# EAGLE design HexJacks (EAGLE 6.6.0)
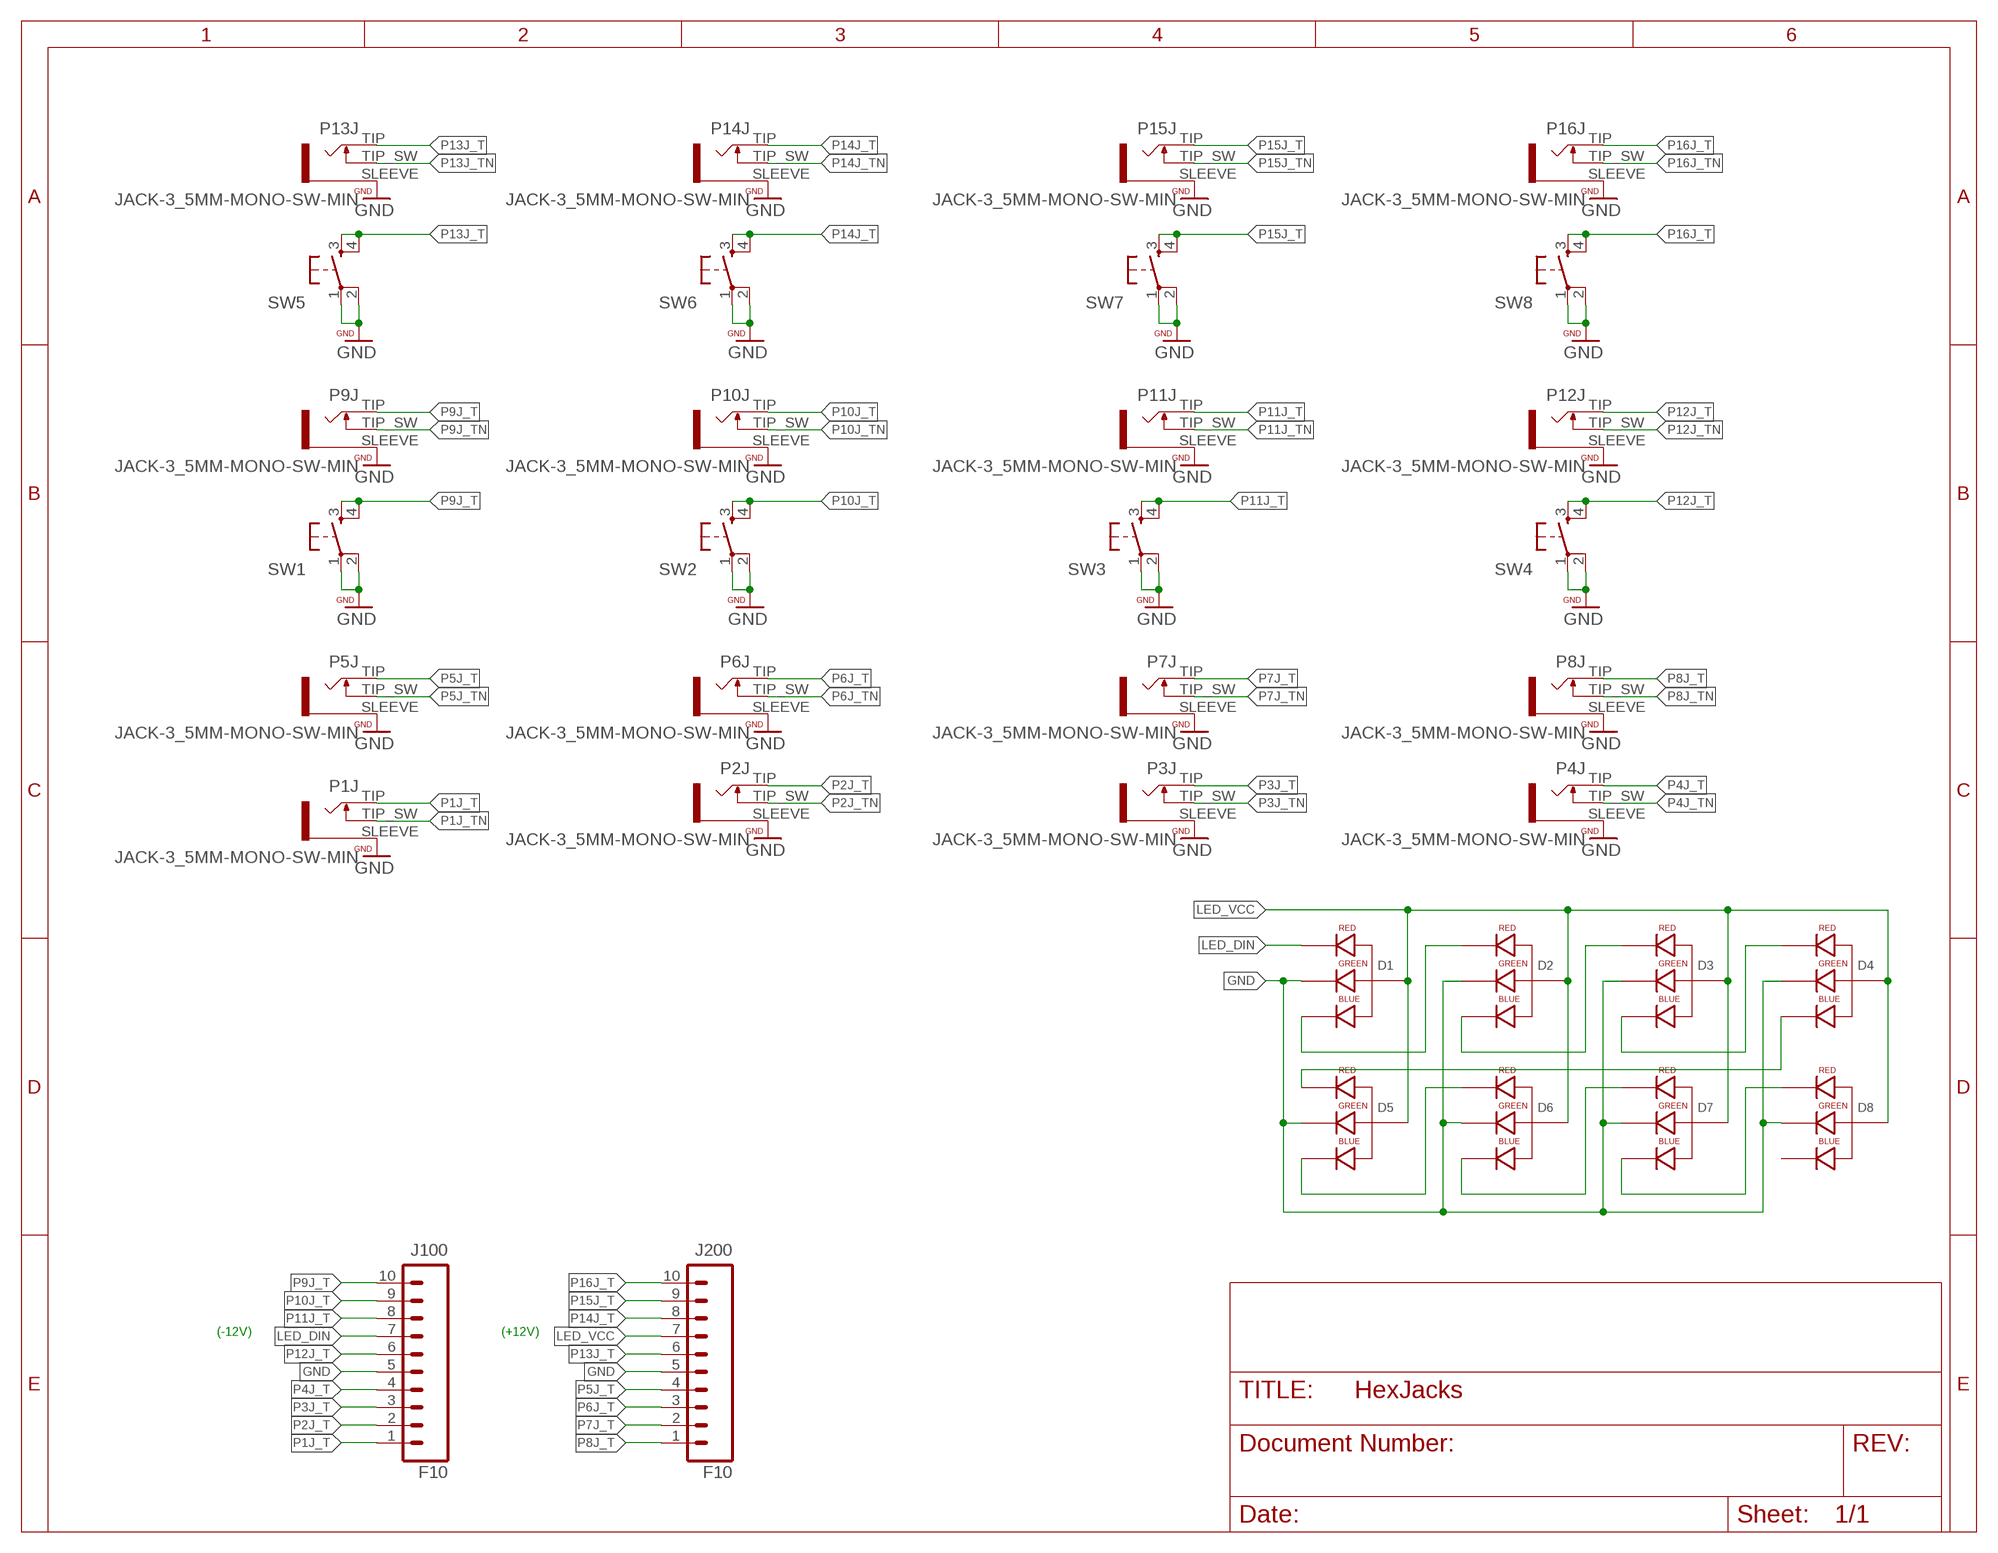
[diagram p0: schematic, sheet 1]

## Parts
D1  LED-RGB-CA-THRUCLEAR  [LED-RGB-THRU]
D2  LED-RGB-CA-THRUCLEAR  [LED-RGB-THRU]
D3  LED-RGB-CA-THRUCLEAR  [LED-RGB-THRU]
D4  LED-RGB-CA-THRUCLEAR  [LED-RGB-THRU]
D5  LED-RGB-CA-THRUCLEAR  [LED-RGB-THRU]
D6  LED-RGB-CA-THRUCLEAR  [LED-RGB-THRU]
D7  LED-RGB-CA-THRUCLEAR  [LED-RGB-THRU]
D8  LED-RGB-CA-THRUCLEAR  [LED-RGB-THRU]
J100  F10  M10SILK_FEMALE_PTH  [1X10_OCTO]
J200  F10  M10SILK_FEMALE_PTH  [1X10_OCTO]
P1J  JACK-3_5MM-MONO-SW-MIN  [WQP_PJ301M-MIN]
P2J  JACK-3_5MM-MONO-SW-MIN  [WQP_PJ301M-MIN]
P3J  JACK-3_5MM-MONO-SW-MIN  [WQP_PJ301M-MIN]
P4J  JACK-3_5MM-MONO-SW-MIN  [WQP_PJ301M-MIN]
P5J  JACK-3_5MM-MONO-SW-MIN  [WQP_PJ301M-MIN]
P6J  JACK-3_5MM-MONO-SW-MIN  [WQP_PJ301M-MIN]
P7J  JACK-3_5MM-MONO-SW-MIN  [WQP_PJ301M-MIN]
P8J  JACK-3_5MM-MONO-SW-MIN  [WQP_PJ301M-MIN]
P9J  JACK-3_5MM-MONO-SW-MIN  [WQP_PJ301M-MIN]
P10J  JACK-3_5MM-MONO-SW-MIN  [WQP_PJ301M-MIN]
P11J  JACK-3_5MM-MONO-SW-MIN  [WQP_PJ301M-MIN]
P12J  JACK-3_5MM-MONO-SW-MIN  [WQP_PJ301M-MIN]
P13J  JACK-3_5MM-MONO-SW-MIN  [WQP_PJ301M-MIN]
P14J  JACK-3_5MM-MONO-SW-MIN  [WQP_PJ301M-MIN]
P15J  JACK-3_5MM-MONO-SW-MIN  [WQP_PJ301M-MIN]
P16J  JACK-3_5MM-MONO-SW-MIN  [WQP_PJ301M-MIN]
SW1  TAC_SWITCHPTH  [TACTILE-PTH]
SW2  TAC_SWITCHPTH  [TACTILE-PTH]
SW3  TAC_SWITCHPTH  [TACTILE-PTH]
SW4  TAC_SWITCHPTH  [TACTILE-PTH]
SW5  TAC_SWITCHPTH  [TACTILE-PTH]
SW6  TAC_SWITCHPTH  [TACTILE-PTH]
SW7  TAC_SWITCHPTH  [TACTILE-PTH]
SW8  TAC_SWITCHPTH  [TACTILE-PTH]

## Nets
GND: D1.3(GREEN_CATHODE) D2.3(GREEN_CATHODE) D3.3(GREEN_CATHODE) D4.3(GREEN_CATHODE) D5.3(GREEN_CATHODE) D6.3(GREEN_CATHODE) D7.3(GREEN_CATHODE) D8.3(GREEN_CATHODE) J100.5 J200.5 P1J.SLEEVE P2J.SLEEVE P3J.SLEEVE P4J.SLEEVE P5J.SLEEVE P6J.SLEEVE P7J.SLEEVE P8J.SLEEVE P9J.SLEEVE P10J.SLEEVE P11J.SLEEVE P12J.SLEEVE P13J.SLEEVE P14J.SLEEVE P15J.SLEEVE P16J.SLEEVE SW1.1 SW1.2 SW2.1 SW2.2 SW3.1 SW3.2 SW4.1 SW4.2 SW5.1 SW5.2 SW6.1 SW6.2 SW7.1 SW7.2 SW8.1 SW8.2
LED_DIN: D1.1(RED_CATHODE) J100.7
LED_VCC: D1.2(ANODE) D2.2(ANODE) D3.2(ANODE) D4.2(ANODE) D5.2(ANODE) D6.2(ANODE) D7.2(ANODE) D8.2(ANODE) J200.7
N$1: D1.4(BLUE_CATHODE) D2.1(RED_CATHODE)
N$2: D2.4(BLUE_CATHODE) D3.1(RED_CATHODE)
N$3: D3.4(BLUE_CATHODE) D4.1(RED_CATHODE)
N$4: D4.4(BLUE_CATHODE) D5.1(RED_CATHODE)
N$5: D5.4(BLUE_CATHODE) D6.1(RED_CATHODE)
N$6: D6.4(BLUE_CATHODE) D7.1(RED_CATHODE)
N$7: D7.4(BLUE_CATHODE) D8.1(RED_CATHODE)
P1J_T: J100.1 P1J.TIP
P1J_TN: P1J.TIP_SW
P2J_T: J100.2 P2J.TIP
P2J_TN: P2J.TIP_SW
P3J_T: J100.3 P3J.TIP
P3J_TN: P3J.TIP_SW
P4J_T: J100.4 P4J.TIP
P4J_TN: P4J.TIP_SW
P5J_T: J200.4 P5J.TIP
P5J_TN: P5J.TIP_SW
P6J_T: J200.3 P6J.TIP
P6J_TN: P6J.TIP_SW
P7J_T: J200.2 P7J.TIP
P7J_TN: P7J.TIP_SW
P8J_T: J200.1 P8J.TIP
P8J_TN: P8J.TIP_SW
P9J_T: J100.10 P9J.TIP SW1.3 SW1.4
P9J_TN: P9J.TIP_SW
P10J_T: J100.9 P10J.TIP SW2.3 SW2.4
P10J_TN: P10J.TIP_SW
P11J_T: J100.8 P11J.TIP SW3.3 SW3.4
P11J_TN: P11J.TIP_SW
P12J_T: J100.6 P12J.TIP SW4.3 SW4.4
P12J_TN: P12J.TIP_SW
P13J_T: J200.6 P13J.TIP SW5.3 SW5.4
P13J_TN: P13J.TIP_SW
P14J_T: J200.8 P14J.TIP SW6.3 SW6.4
P14J_TN: P14J.TIP_SW
P15J_T: J200.9 P15J.TIP SW7.3 SW7.4
P15J_TN: P15J.TIP_SW
P16J_T: J200.10 P16J.TIP SW8.3 SW8.4
P16J_TN: P16J.TIP_SW
Unconnected: D8.4(BLUE_CATHODE)

## Notes on the sheet
- (-12V) | (+12V)

## Library data of the parts
D1-D8 = halcyonmod_Optoelectronics:LED-RGB-CA-THRU: RGB Through-hole common anode SparkFun store front COM-10821 (diffuse) COM-10820 (clear); PROD_ID: DIO-10631
J100 J200 = oXo_Connectors:M10: Header 10 Standard 10-pin 0.1" header. Use with straight break away headers (SKU : PRT-00116), right angle break away headers (PRT-00553), swiss pins (PRT-00743), machine pins (PRT-00117), and female headers (PRT-00115).; PROD_ID: CONN-11563
P1J P2J P3J P4J P5J P6J P7J P8J P9J P10J P11J P12J P13J P14J P15J P16J = halcyonmod_Connectors:JACK-3_5MM-MONO-SW: Jack, 3.5mm, RIght Angle, Though-Hole
SW1-SW8 = SparkFun:TAC_SWITCH: Momentary Switch Button commonly used for reset or general input. Spark Fun Electronics SKU : COM-00097

## Board
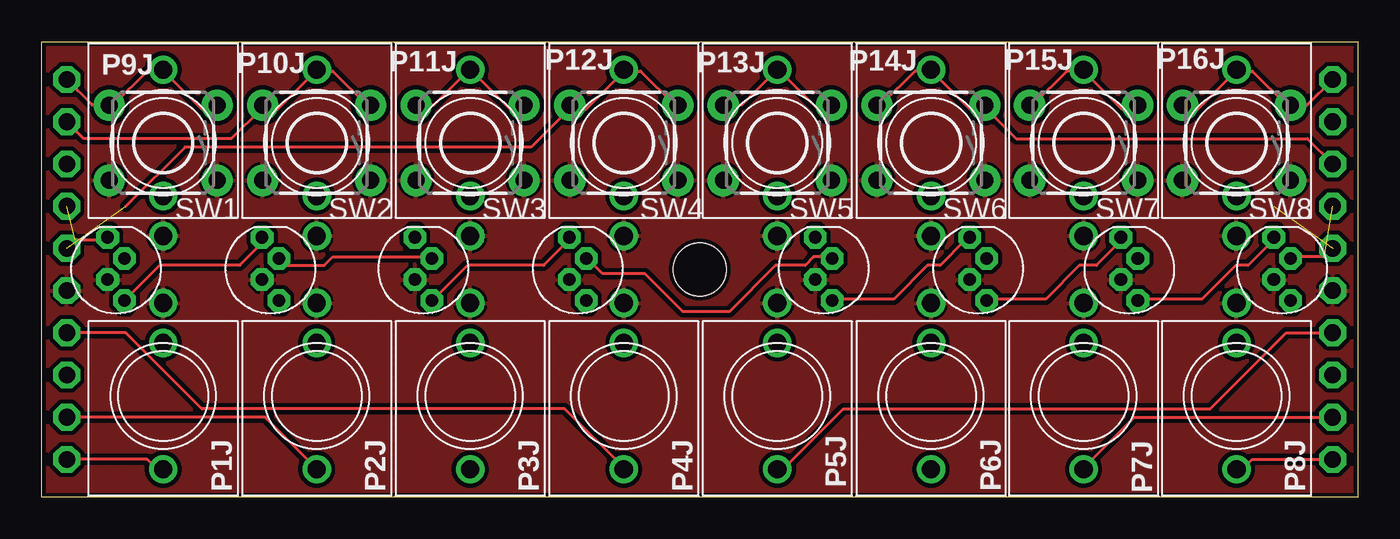
[diagram p1: board, top side]
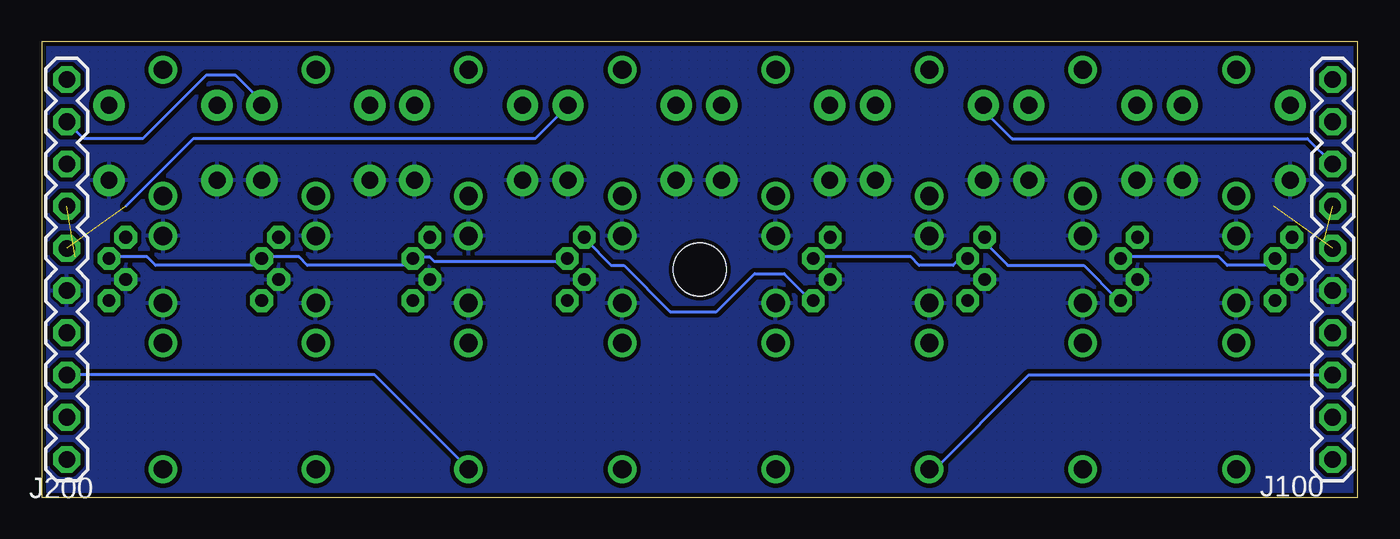
[diagram p2: board, bottom side, seen from below]

Size 79.25 x 27.43 mm. Coordinates in mm from the lower left corner, seen from the top.
Outline: 79.25,0 0,0 0,27.43 79.25,27.43 79.25,0
Copper layers (1*16): Top 0.035mm / dielectric 1.5mm / Bottom 0.035mm
Design rules "PatternAgents_7mil": minimum track width 7mil, minimum drill 14mil, track to track 7mil, track to pad 7mil, pad to pad 7mil, via to via 7mil, smd to smd 7mil, copper to edge 7mil, drill to drill 7mil, minimum pad ring 12mil, minimum via ring 10mil, stop-mask expansion 4mil, vias tented up to drill 25mil, thermal gap 7mil
Holes 3.2 mm at 39.62,13.72

### Footprints (pad centres in the part's own frame; a part is rotated, then mirrored left to right if it is on the bottom)
LED-RGB-THRU = drill 0.762 pad 0.889 octagon: 1 1.905,0.508; 2 0.635,-0.508; 3 -0.635,0.508; 4 -1.905,-0.508
1X10_OCTO = drill 1 octagon: 1 0,0; 2 2.54,0; 3 5.08,0; 4 7.62,0; 5 10.16,0; 6 12.7,0; 7 15.24,0; 8 17.78,0; 9 20.32,0; 10 22.86,0
WQP_PJ301M-MIN = drill 1.1: SLEEVE 0,-5.6; TIP 0,4.4; TIP_SW 0,-3.2
TACTILE-PTH = drill 1.016 pad 1.88: 1 -3.251,2.261; 2 3.251,2.261; 3 -3.251,-2.261; 4 3.251,-2.261

### Placement (x,y rotation side)
D1  4.48,13.75 90 top
D2  13.78,13.75 90 top
D3  22.98,13.75 90 top
D4  32.28,13.75 90 top
D5  47.08,13.75 90 top
D6  56.38,13.75 90 top
D7  65.48,13.75 90 top
D8  74.68,13.75 90 top
J100  1.52,2.29 90 bottom
J200  77.72,2.29 90 bottom
P1J  7.32,6.1 180 top
P2J  16.56,6.1 180 top
P3J  25.8,6.1 180 top
P4J  35.05,6.1 180 top
P5J  44.29,6.1 180 top
P6J  53.54,6.1 180 top
P7J  62.73,6.1 180 top
P8J  71.93,6.1 180 top
P9J  7.32,21.34 0 top
P10J  16.56,21.34 0 top
P11J  25.8,21.34 0 top
P12J  35.05,21.34 0 top
P13J  44.29,21.34 0 top
P14J  53.54,21.34 0 top
P15J  62.73,21.34 0 top
P16J  71.93,21.34 0 top
SW1  7.32,21.34 180 top
SW2  16.56,21.34 180 top
SW3  25.8,21.34 180 top
SW4  35.05,21.34 180 top
SW5  44.29,21.34 180 top
SW6  53.54,21.34 180 top
SW7  62.73,21.34 180 top
SW8  71.93,21.34 180 top

### Tracks (layer width: path | path; a pad name or v marks a point on that pad's centre or on a via)
GND
  pour Bottom (isolate 0.254, hatched): 0,0 0,27.43 79.25,27.43 79.25,0
  pour Top (isolate 0.254, hatched): 0,0 0,27.43 79.25,27.43 79.25,0
LED_DIN  (1 unrouted)
  Top 0.178: 2.03,15.49 3.81,15.49 D1.1
LED_VCC  (1 unrouted)
  Top 0.178: D3.2 23.62,14.48 17.53,14.48 17.02,13.97 14.73,13.97 14.48,14.22 D2.2 | 77.22,14.48 75.18,14.48 D8.2 | D4.2 33.02,14.22 33.78,13.46 36.32,13.46 38.61,11.18 41.4,11.18 44.2,13.97 45.97,13.97 46.48,14.48 47.5,14.48 D5.2
  Bottom 0.178: D2.2 14.22,14.48 8.38,14.48 7.87,13.97 5.33,13.97 5.08,14.22 D1.2 | D4.2 32.77,14.48 26.92,14.48 26.42,13.97 24.38,13.97 23.88,14.48 D3.2 | D5.2 47.5,14.22 55.63,14.22 55.88,14.48 56.64,14.48 D6.2 56.64,14.22 56.9,13.97 63.25,13.97 63.75,14.48 66.04,14.48 D7.2 66.04,14.22 66.29,13.97 72.39,13.97 72.9,14.48 75.18,14.48 D8.2
N$1
  Top 0.178: D1.4 5.08,11.94 7.11,13.97 11.94,13.97 13.46,15.49 D2.1
N$2
  Bottom 0.178: D2.4 14.48,11.94 16.51,13.97 21.08,13.97 22.61,15.49 D3.1
N$3
  Top 0.178: D3.4 23.88,11.94 23.88,12.19 25.65,13.97 30.23,13.97 31.75,15.49 D4.1
N$4
  Bottom 0.178: D4.4 33.02,11.94 34.54,13.46 36.32,13.46 38.61,11.18 41.4,11.18 44.2,13.97 44.96,13.97 46.48,15.49 D5.1
N$5
  Top 0.178: D5.4 47.5,11.94 51.31,11.94 53.34,13.97 54.1,13.97 55.63,15.49 D6.1
N$6
  Top 0.178: D6.4 56.64,11.94 60.45,11.94 62.48,13.97 63.5,13.97 65.02,15.49 D7.1
N$7
  Top 0.178: D7.4 66.04,11.94 69.85,11.94 71.88,13.97 72.64,13.97 74.17,15.49 D8.1
P1J_T
  Top 0.178: J100.1 6.35,2.29 7.11,1.52 P1J.TIP
P2J_T
  Top 0.178: J100.2 13.46,4.83 16.51,1.78 P2J.TIP
P3J_T
  Bottom 0.178: J100.3 19.81,7.37 25.65,1.52 P3J.TIP
P4J_T
  Top 0.178: J100.4 5.08,9.91 9.65,5.33 31.5,5.33 35.05,1.78 P4J.TIP
P5J_T
  Top 0.178: J200.4 74.93,9.91 70.36,5.33 48.26,5.33 44.45,1.52 P5J.TIP
P6J_T
  Bottom 0.178: J200.3 59.18,7.37 53.59,1.78 P6J.TIP
P7J_T
  Top 0.178: J200.2 65.79,4.83 62.74,1.78 P7J.TIP
P8J_T
  Top 0.178: J200.1 72.9,2.29 72.14,1.52 P8J.TIP
P9J_T
  Top 0.178: J100.10 3.05,23.62 4.06,23.62 SW1.4 4.32,23.62 6.35,25.65 7.11,25.65 P9J.TIP 7.37,25.65 9.65,23.37 10.41,23.37 SW1.3
P10J_T
  Top 0.178: J100.9 2.54,21.59 11.43,21.59 13.21,23.37 SW2.4 13.46,23.37 14.22,23.37 16.51,25.65 P10J.TIP 16.76,25.65 17.53,25.65 19.56,23.62 SW2.3
P11J_T
  Top 0.178: SW3.3 28.96,23.37 28.19,23.37 25.91,25.65 P11J.TIP 25.65,25.65 23.62,23.62 22.86,23.62 SW3.4
  Bottom 0.178: J100.8 3.05,21.59 20.83,21.59 22.61,23.37 SW3.4
P12J_T  (1 unrouted)
  Top 0.178: 5.08,17.53 8.64,21.08 29.46,21.08 31.75,23.37 SW4.4 32,23.37 32.77,23.37 35.05,25.65 P12J.TIP 35.31,25.65 36.07,25.65 38.1,23.62 SW4.3
P13J_T  (1 unrouted)
  Top 0.178: SW5.4 41.4,23.62 42.16,23.62 44.2,25.65 P13J.TIP 44.45,25.65 46.74,23.37 47.5,23.37 SW5.3
  Bottom 0.178: 74.17,17.53 70.1,21.59 49.53,21.59 47.75,23.37 SW5.3
P14J_T
  Top 0.178: J200.8 76.2,21.59 58.67,21.59 56.9,23.37 SW6.3 56.64,23.37 55.88,23.37 53.59,25.65 P14J.TIP 53.34,25.65 52.58,25.65 50.55,23.62 SW6.4
P15J_T
  Top 0.178: SW7.3 65.79,23.37 65.02,23.37 62.74,25.65 P15J.TIP 62.48,25.65 61.72,25.65 59.69,23.62 SW7.4
  Bottom 0.178: J200.9 76.71,21.59 73.15,21.59 69.34,25.4 67.56,25.4 65.79,23.62 SW7.3
P16J_T
  Top 0.178: J200.10 76.2,23.62 75.18,23.62 SW8.3 74.93,23.62 72.9,25.65 72.14,25.65 P16J.TIP 71.88,25.65 69.6,23.37 68.83,23.37 SW8.4